# Altium schematic sheet Sheet4.SchDoc
size A4
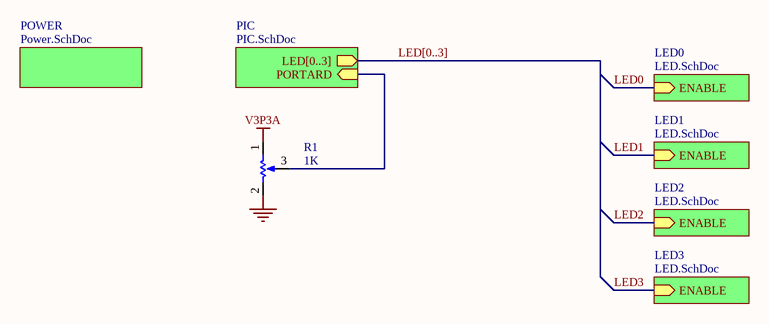
[diagram p0: Sheet4.SchDoc]

## Parts
R1  1K  [PDB181-K415K-102A2]

## Sub-sheets
LED0 = LED.SchDoc: ENABLE (in)
LED1 = LED.SchDoc: ENABLE (in)
LED2 = LED.SchDoc: ENABLE (in)
LED3 = LED.SchDoc: ENABLE (in)
PIC = PIC.SchDoc: PORTARD (in), LED[0..3] (out)
POWER = Power.SchDoc: no entries

## Nets
GND: R1.2(BOT)
V3P3A: R1.1(TOP)
LED0: sheet LED0/ENABLE
LED1: sheet LED1/ENABLE
LED2: sheet LED2/ENABLE
LED3: sheet LED3/ENABLE
NetR1_3: R1.3(TAP) ; sheet PIC/PORTARD

## Buses and harness runs
bus LED[0..3] = sheet PIC/LED[0..3]

## Library data of the parts
R1 = RPot: Potentiometer; Fournisseur: Farnell; Fabricant: BOURNS; Ref.Fournisseur: 1823540; Ref.Fabricant: PDB181-K415K-102A2; Valeur: 1K